# Altium schematic sheet AC DC.SchDoc
size A3; SheetNumber: 2; SheetTotal: 8
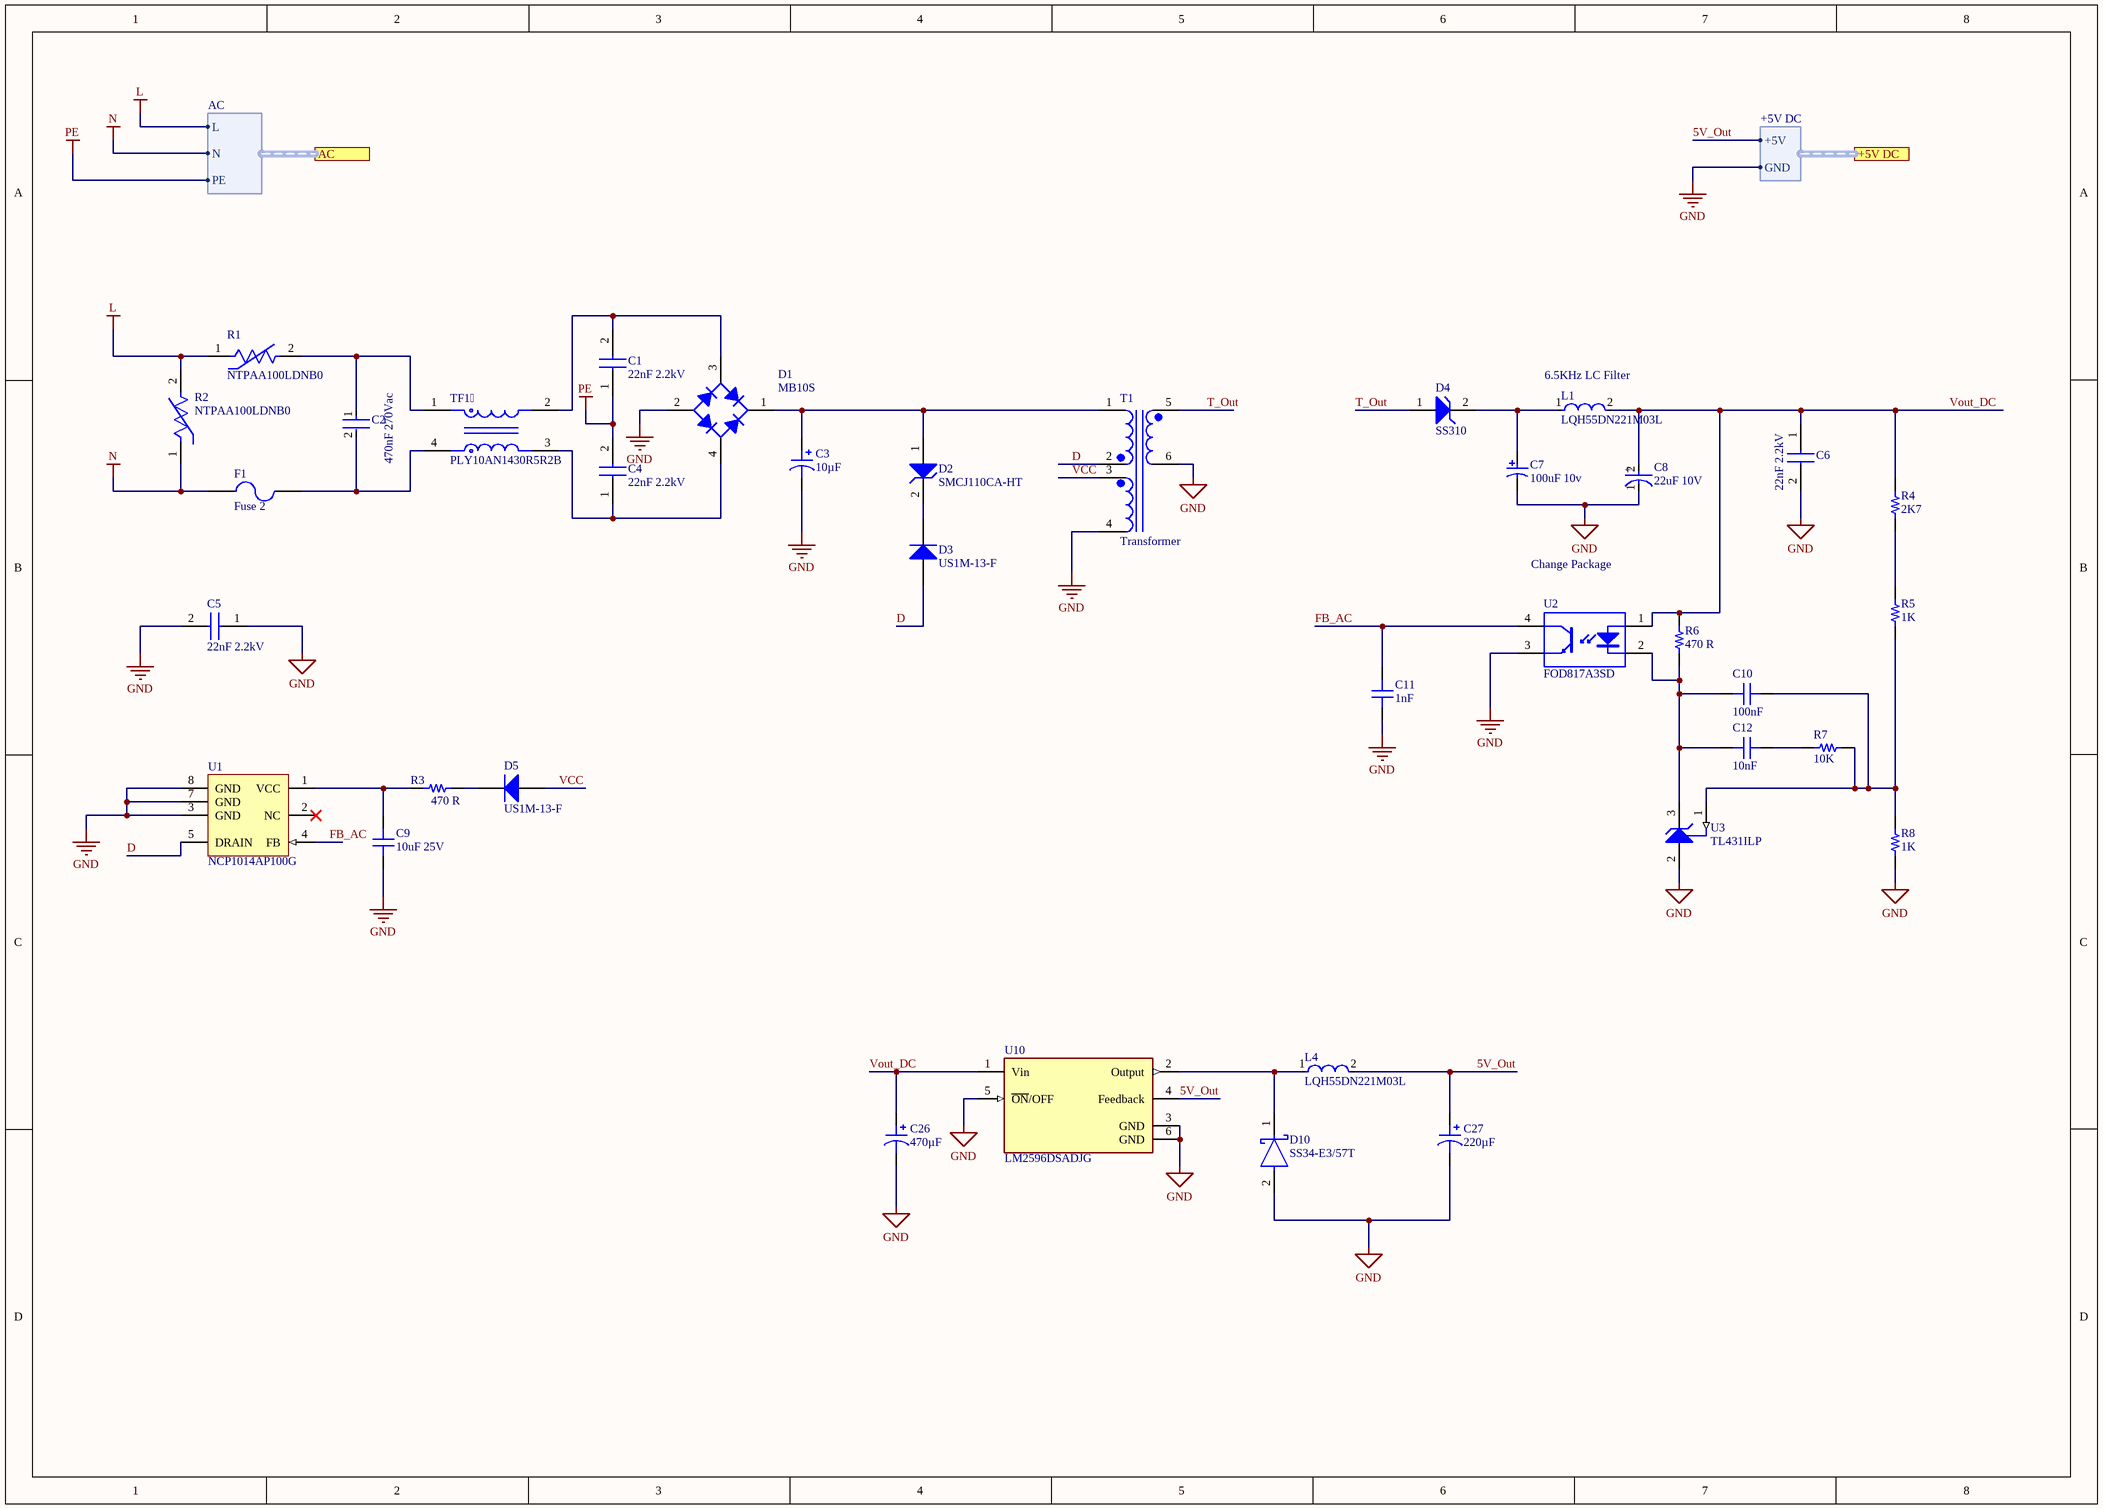
[diagram p0: AC DC.SchDoc]

## Parts
C1  22nF 2.2kV  [C901U102MYWDBA7317]
C2  470nF 270Vac  [FP-PME295RB4470MR30-MFG]
C3  10µF  [CAP TH ALUM ELEC D10.00mm S5.00mm H13.50mm]
C4  22nF 2.2kV  [C901U102MYWDBA7317]
C5  22nF 2.2kV  [C901U102MYWDBA7317]
C6  22nF 2.2kV  [C901U102MYWDBA7317]
C7  100uF 10v  [KEMT-T491-C_L]
C8  22uF 10V  [FP-T491B107M010AT-MFG]
C9  10uF 25V  [CAP 0805_2012]
C10  100nF  [CAP 0402_1005]
C11  1nF  [CAP 0603_1608]
C12  10nF  [CAP 0402_1005]
C26  470µF  [CAP TH ALUM ELEC D10.00mm S5.00mm H17.00mm]
C27  220µF  [CAP TH ALUM ELEC D8.00mm S3.50mm H12.50mm]
D1  MB10S  [FP-751EP-MFG]
D2  SMCJ110CA-HT  [STM-SMC_V]
D3  US1M-13-F  [DIOD-SMA-2_A_V]
D4  SS310  [STM-SMC_V]
D5  US1M-13-F  [DIOD-SMA-2_A_V]
D10  SS34-E3/57T  [FP-95402-MFG]
F1  Fuse 2  [PIN-W2/E2.8]
L1  LQH55DN221M03L  [FP-LQH55DN_03-MFG(100uH)]
L4  LQH55DN221M03L  [FP-LQH55DN_03-MFG(68uH) - duplicate]
R1  NTPAA100LDNB0  [FP-NTPAA-MFG]
R2  NTPAA100LDNB0  [FP-NTPAA-MFG]
R3  470 R  [RES 0805_2012]
R4  2K7  [RES 0805_2012]
R5  1K  [RES 0805_2012]
R6  470 R  [RES 0805_2012]
R7  10K  [RES 0805_2012]
R8  1K  [RES 0805_2012]
T1  Transformer
TF1  PLY10AN1430R5R2B  [FP-PLY10A-MFG]
U1  NCP1014AP100G  [ONSC-PDIP-7-626AB]
U2  FOD817A3SD  [FAIR-SMT-4_V]
U3  TL431ILP  [LP0003A]
U10  LM2596DSADJG  [FP-936A-02-MFG]

## Ports
+5V DC (harness +5V DC), AC (harness AC)

## Harnesses
AC: L, N, PE
+5V DC: +5V, GND

## Nets
GND: C3.2 C5.1 C5.2 C6.2 C7.2 C8.1(C) C9.1 C11.1 C26.2 C27.2 D1.2 D10.2(A) R8.1 T1.4 T1.6 U1.3(GND) U1.7(GND) U1.8(GND) U2.3(EMITTER) U3.2(ANODE) U10.3(GND) U10.5(~{ON}/OFF) U10.6(GND) ; port +5V DC.GND
L: R1.1 R2.2 ; port AC.L
N: F1.1 R2.1 ; port AC.N
PE: C1.1 C4.2 ; port AC.PE
5V_Out: C27.1 L4.2 U10.4(Feedback) ; port +5V DC.+5V
D: D3.1(A) T1.2 U1.5(DRAIN)
FB_AC: C11.2 U1.4(FB) U2.4(COLLECTOR)
T_Out: D4.1(A) T1.5
VCC: D5.1(A) T1.3
Vout_DC: C6.1 C8.2(A) C26.1 L1.2 R4.2 R6.2 U2.1(ANODE) U10.1(Vin)
NetC1_2: C1.2 D1.3 TF1.2
NetC2_1: C2.1 R1.2 TF1.1
NetC2_2: C2.2 F1.2 TF1.4
NetC3_1: C3.1 D1.1 D2.1(A) T1.1
NetC4_1: C4.1 D1.4 TF1.3
NetC7_1: C7.1 D4.2(K) L1.1
NetC9_2: C9.2 R3.1 U1.1(VCC)
NetC10_1: C10.1 C12.1 R6.1 U2.2(CATHODE) U3.3(CATHODE)
NetC10_2: C10.2 R5.1 R7.1 R8.2 U3.1(REF)
NetC12_2: C12.2 R7.2
NetD2_2: D2.2(K) D3.2(K)
NetD5_2: D5.2(K) R3.2
NetD10_1: D10.1(C) L4.1 U10.2(Output)
NetR4_1: R4.1 R5.2

Not connected (* = marked no-connect by the designer): U1 2(NC)*

## Notes on the sheet
- (near L1) 6.5KHz LC Filter
- Change Package
- (in symbol CMP-03017-000045-1) +

## Library data of the parts
C1 C4-C6 = C901U102MYWDBA7317: Capacitor; Manufacturer_Name: Kemet; Datasheet Link: https://componentsearchengine.com/Datasheets/2/C901U102MYWDBA7317.pdf; Height: 10mm; Manufacturer_Part_Number: C901U102MYWDBA7317; Mouser Part Number: 80-C901U102MYWDBAP; Mouser Price/Stock: https://www.mouser.co.uk/ProductDetail/KEMET/C901U102MYWDBA7317?qs=gqcQgTT0fkjoP%252BsjEfHKjQ%3D%3D
C2 = CMP-03022-000001-1: CAP FILM 4700PF 20% 1.5KVDC RAD; Manufacturer: Kemet; Manufacturer Part Number: PME295RB4470MR30; Material: Metallized Impregnated Paper; Value: 0.0047uF; Voltage Rating: 1500V; Voltage Rating Ac: 480V; Lead Free: Yes; Category: Cap; ComponentLink2URL: https://content.kemet.com/datasheets/KEM_F3064_PME295_Y1_440-480.pdf; RoHS: TRUE; ComponentLink2Description: Datasheet; Device Class L1: Passive Components; Octopart: https://octopart.com/pme295rb4470mr30-kemet-8375873; Temperature: -40°C to +115°C; Temperature Range Low: -40°C; Automotive: No; Height: 16mm; Mouser Description: Film Capacitors 440volts 4700pF 20% LS 15mm; Capacitance: 0.0047uF; Temperature Range High: +115°C; Tolerance: 20%; Device Class L3: Film Capacitors; Device Class L2: Capacitors; Package: 0; Digikey Description: CAP FILM 4700PF 20% 1.5KVDC RAD
C3 = ECA-2CM100: CAP ALUM 10UF 20% 160V RADIAL; Manufacturer: Panasonic Electronic Components; Lifetime @ Temp.: 2000 Hrs @ 85°C; Polarization: Polar; Ripple Current @ High Frequency: 178.5mA @ 10kHz; Ripple Current @ Low Frequency: 105mA @ 120Hz; Part Number: ECA-2CM100; Applications: General Purpose; Capacitance: 10µF; ComponentLink1Description: Datasheet; ComponentLink1URL: //media.digikey.com/pdf/Data%20Sheets/Panasonic%20Electronic%20Components/ECA-xxM%20Series,TypeA.pdf; ComponentLink2Description: DigiKey Link; ComponentLink2URL: http://digikey.com/product-detail/en/panasonic-electronic-components/ECA-2CM100/P5322-ND/245076; Device Package: Radial, Can; Height - Seated (Max): 0.532" (13.50mm); LastUpdated: 2.09.2020 01:31:06; Lead Spacing: 0.197" (5.00mm); Lifecycle Status: Active; Minimum Order: 1; Mounting Type: Through Hole; Operating Temperature: -25°C ~ 85°C; Package / Case: Radial, Can; Packaging: Bulk; PartId: 10778; Part Status: Active; Price: 0.48; Series: M; Size / Dimension: 0.394" Dia (10.00mm); Supplier 1: DigiKey; Supplier Part Number 1: P5322-ND; Tolerance: ±20%; Value: 10µF; Voltage - Rated: 160V
C7 = CMP-2000-07195-1: Tantalum Capacitor, 1 uF, +/- 10%, 50 V, -55 to 125 degC, 2-Pin SMD, RoHS, Tape and Reel; Manufacturer: Kemet; Capacitance: 1000000pF; Rad Hardened: No; Case Style: Molded; Product Diameter (mm): NotRequiredmm; Seal: NotRequired; DF: 4%; ESR: 5.5ohm; DCL: 0.5uA; Product Length (mm): 6mm; Product Height (mm): 2.5mm; Polarity: Polar; Voltage: 50VDC; Product Depth (mm): 3.2mm; Operating Temp Range: -55Cto125C; Package Description: 2-Pin Surface Mount Device, Body 6 x 3.2 mm; Failure Rate: NotRequired; Seated Plane Height: NotRequiredmm; Lead Spacing (nom): NotRequiredmm; Packaging: TapeandReel; Case Code: C; Length W/Weld: NotRequiredmm; Tolerance (+ or -): 10%; Datasheet URL: http://capacitoredge.kemet.com/capedge2/DataSheet/Datasheet-T491C105K050AT.pdf?pn=T491C105K050AT; Datasheet Version: 10/2016; Manufacturer URL: http://www.kemet.com/; Wire Form: NotRequired; Package / Case: 6032-28; Mounting Technology: SurfaceMount; Construction: SMTChip; Package Reference: T491-C; Length W/Weld (max): NotRequiredmm; Insulation: NotRequired; Mounting Style: SurfaceMount
C8 = CMP-03017-000045-1: CAP TANT 100UF 20% 10V 1411; Tolerance: 10%; ESR (Equivalent Series Resistance): 3R; Life (Hours): 2000Hour; Polarity: Polar; Dissipation Factor: 15%; Weight: 0.002293oz; Packaging: Tape and Reel; Package Quantity: 1; Case Code (Imperial): 1411; Width: 0.11inch; Mount: Surface Mount; Construction: Flat; Radiation Hardening: No; Height - Seated (Max): 0.083inch; Capacitance: 100uF; Length: 3.5mm; RoHS Compliant: Yes; Voltage Rating: 10V; Voltage Rating (DC): 10V; Features: General Purpose; REACH SVHC: No SVHC; Case/Package: 1411; Case Code (Metric): 3528; Series: T491; Depth: 2.8mm; Height: 2.1mm; Lead Free: Lead Free; Max Operating Temperature: 125°C; Voltage: 10V; Termination: SMD/SMT; Min Operating Temperature: -55°C
C9 = CBR08C330JAGAC: CAP CER 33PF 250V C0G/NP0 0805; Manufacturer: KEMET; Temperature Coefficient: C0G, NP0; Tolerance: ±5%; Part Number: CBR08C330JAGAC; Value: 10uF 25V; Applications: RF, Microwave, High Frequency; Capacitance: 33pF; ComponentLink1Description: Datasheet; ComponentLink1URL: https://api.kemet.com/component-edge/download/datasheet/CBR08C330JAGAC.pdf; ComponentLink2Description: DigiKey Link; ComponentLink2URL: http://digikey.com/product-detail/en/kemet/CBR08C330JAGAC/399-6202-1-ND/2732182; Device Package: 0805 (2012 Metric); Features: High Q, Low Loss, Ultra Low ESR; LastUpdated: 2.09.2020 01:04:42; Lifecycle Status: Active; Minimum Order: 1; Mounting Type: Surface Mount, MLCC; Operating Temperature: -55°C ~ 125°C; Package / Case: 0805 (2012 Metric); Packaging: TapeAndReel; PartId: 2409; Part Status: Active; Price: 0.44; Series: CBR-SMD RF C0G; Size / Dimension: 0.079" L x 0.049" W (2.00mm x 1.25mm); Supplier 1: DigiKey; Supplier Part Number 1: 399-6202-1-ND; Thickness (Max): 0.035" (0.88mm); Voltage - Rated: 250V
C10 C12 = C0402C151F5GAC7867: CAP CER 150PF 50V NP0 0402; Manufacturer: KEMET; Temperature Coefficient: C0G, NP0; Tolerance: ±1%; Part Number: C0402C151F5GAC7867; Applications: General Purpose; Capacitance: 150pF; ComponentLink1Description: Datasheet; ComponentLink1URL: https://api.kemet.com/component-edge/download/datasheet/C0402C151F5GAC7867.pdf; ComponentLink2Description: DigiKey Link; ComponentLink2URL: http://digikey.com/product-detail/en/kemet/C0402C151F5GAC7867/399-14269-1-ND/6827260; Device Package: 0402 (1005 Metric); Features: Low ESL; LastUpdated: 2.09.2020 01:02:26; Lifecycle Status: Active; Minimum Order: 1; Mounting Type: Surface Mount, MLCC; Operating Temperature: -55°C ~ 125°C; Package / Case: 0402 (1005 Metric); Packaging: TapeAndReel; PartId: 1709; Part Status: Active; Price: 0.43; Series: SMD Comm C0G; Size / Dimension: 0.039" L x 0.020" W (1.00mm x 0.50mm); Supplier 1: DigiKey; Supplier Part Number 1: 399-14269-1-ND; Thickness (Max): 0.022" (0.55mm); Voltage - Rated: 50V
  C10: Value: 100nF
  C12: Value: 10nF
C11 = C0603X101F5GACAUTO: CAP CER 100PF 50V C0G/NP0 0603; Manufacturer: KEMET; Temperature Coefficient: C0G, NP0; Tolerance: ±1%; Part Number: C0603X101F5GACAUTO; Value: 1nF; Applications: Automotive, Boardflex Sensitive; Capacitance: 100pF; ComponentLink1Description: Datasheet; ComponentLink1URL: https://api.kemet.com/component-edge/download/datasheet/C0603X101F5GACAUTO.pdf; ComponentLink2Description: DigiKey Link; ComponentLink2URL: http://digikey.com/product-detail/en/kemet/C0603X101F5GACAUTO/399-20434-1-ND/9925038; Device Package: 0603 (1608 Metric); Features: Low ESL, Soft Termination; LastUpdated: 2.09.2020 01:03:36; Lifecycle Status: Active; Minimum Order: 1; Mounting Type: Surface Mount, MLCC; Operating Temperature: -55°C ~ 125°C; Package / Case: 0603 (1608 Metric); Packaging: TapeAndReel; PartId: 2136; Part Status: Active; Price: 0.44; Ratings: AEC-Q200; Series: SMD Auto C0G Flex; Size / Dimension: 0.063" L x 0.031" W (1.60mm x 0.80mm); Supplier 1: DigiKey; Supplier Part Number 1: 399-20434-1-ND; Thickness (Max): 0.037" (0.95mm); Voltage - Rated: 50V
C26 = ECA-1VM471B: CAP ALUM 470UF 20% 35V RADIAL; Manufacturer: Panasonic Electronic Components; Lifetime @ Temp.: 2000 Hrs @ 85°C; Polarization: Polar; Ripple Current @ High Frequency: 935mA @ 10kHz; Ripple Current @ Low Frequency: 550mA @ 120Hz; Part Number: ECA-1VM471B; Applications: General Purpose; Capacitance: 470µF; ComponentLink1Description: Datasheet; ComponentLink1URL: //media.digikey.com/pdf/Data%20Sheets/Panasonic%20Electronic%20Components/ECA-xxM%20Series,TypeA.pdf; ComponentLink2Description: DigiKey Link; ComponentLink2URL: http://digikey.com/product-detail/en/panasonic-electronic-components/ECA-1VM471B/P10386TB-ND/268471; Device Package: Radial, Can; Height - Seated (Max): 0.669" (17.00mm); LastUpdated: 2.09.2020 01:31:21; Lead Spacing: 0.197" (5.00mm); Lifecycle Status: Active; Minimum Order: 500; Mounting Type: Through Hole; Operating Temperature: -40°C ~ 85°C; Package / Case: Radial, Can; Packaging: TapeAndBox; PartId: 11779; Part Status: Active; Price: 0.15; Series: M; Size / Dimension: 0.394" Dia (10.00mm); Supplier 1: DigiKey; Supplier Part Number 1: P10386TB-ND; Tolerance: ±20%; Value: 470µF; Voltage - Rated: 35V
C27 = UKW1E221MPD1TD: CAP ALUM 220UF 20% 25V RADIAL; Manufacturer: Nichicon; Lifetime @ Temp.: 2000 Hrs @ 85°C; Polarization: Polar; Ripple Current @ Low Frequency: 320mA @ 120Hz; Part Number: UKW1E221MPD1TD; Applications: Audio; Capacitance: 220µF; ComponentLink1Description: Datasheet; ComponentLink1URL: http://nichicon-us.com/english/products/pdfs/e-ukw.pdf; ComponentLink2Description: DigiKey Link; ComponentLink2URL: http://digikey.com/product-detail/en/nichicon/UKW1E221MPD1TD/493-10759-1-ND/4317735; Device Package: Radial, Can; Height - Seated (Max): 0.492" (12.50mm); LastUpdated: 7.09.2020 05:24:52; Lead Spacing: 0.138" (3.50mm); Lifecycle Status: Active; Minimum Order: 1; Mounting Type: Through Hole; Operating Temperature: -40°C ~ 85°C; Package / Case: Radial, Can; Packaging: TapeAndBox; PartId: 7197; Part Status: Active; Price: 0.16; Series: UKW; Size / Dimension: 0.315" Dia (8.00mm); Supplier 1: DigiKey; Supplier Part Number 1: 493-10759-1-ND; Tolerance: ±20%; Value: 220µF; Voltage - Rated: 25V
D1 = CMP-07163-000045-1: BRIDGE RECT 1P 1KV 500MA 4SOIC; Capacitance: 470pF; Forward Current: 800mA; Element Configuration: Single; Number of Elements: 1; Max Forward Surge Current (Ifsm): 35A; Lead/Base Style: Formed Leads; Forward Voltage: 1V; Tolerance: 10%; Voltage Rating: 500V; Max Power Dissipation: 1.4W; Peak Reverse Current: 5uA; Case/Package: SOIC; Min Operating Temperature: -55°C; Package Quantity: 500; Height: 2.7mm; Mount: Surface Mount; Average Rectified Current: 500mA; Radiation Hardening: No; Width: 4.2mm; Peak Non-Repetitive Surge Current: 35A; REACH SVHC: No SVHC; Max Repetitive Reverse Voltage (Vrrm): 1kV; Weight: 0.228g; Length: 4.95mm; Height - Seated (Max): 0.354inch; Case Code (Imperial): 1206; Thickness: 0.039inch; Packaging: Tape and Reel; Lead Free: Lead Free; Case Code (Metric): 3216; Contact Plating: Tin; Reverse Voltage (DC): 1kV; Number of Pins: 4; Max Operating Temperature: 150°C; Lead Pitch: 0.197inch; Max Surge Current: 35A
D2 D4 = CMP-0433-00001-1: SMCJ Transil Series Zener Diode, 5V, 5W; PartNumber: SMCJ5.0A-TR; Manufacturer: STMicroelectronics; Junction Temperature: -55 to 150 degC; DatasheetVersion: Rev. 8, 07/2010; ComponentLink1URL: http://www.st.com; ComponentLink2Description: Datasheet; Mounting Technology: Surface Mount; PackageReference: SMC; PackageDescription: 2-Pin C-Bend SMT Diode, 7.9 x 5.9 mm Body; ComponentLink2URL: http://www.st.com/st-web-ui/static/active/en/resource/technical/document/datasheet/CD00001367.pdf; ComponentLink1Description: Manufacturer URL
D3 D5 = CMP-2000-07364-1: Ultra-Fast Rectifier, 1 A, 1.7 V, -65 to 150 degC, 2-Pin SMA, RoHS, Tape and Reel; Manufacturer: Diodes Inc; Forward Voltage: 1.7V; Reverse Recovery Time-Max: 75ns; Average Rectified Current-Max: 1A; Reverse Current-Max: 5µA; Reverse Voltage-Max [Vrrm]: 1000V; Package Description: 2-Pin Surface Mount Device, Body 4.3 x 2.605 mm; Datasheet URL: http://www.diodes.com/_files/datasheets/ds16008.pdf; Datasheet Version: Rev. 11-2, 12/2014; Package Reference: SMA-2; Mounting Technology: SurfaceMount; Manufacturer URL: http://www.diodes.com/
D10 = CMP-02539-000012-1: DIODE SCHOTTKY 40V 3A DO214AB; Manufacturer: Vishay; Max Junction Temp: +150°C; Peak Reverse Current: 0.5mA; Max Surge Forward Current: 100A; Standoff Height: 0mm; ComponentLink2Description: Datasheet; Device Class L3: Schottky Diodes; Height: 2.62mm; Max Repetitive Reverse Voltage: 40V; Lead Free: Yes; Package: 95402; Temperature Range High: +150°C; ComponentLink2URL: http://www.vishay.com/docs/88751/ss32.pdf; Temperature: -55°C to +150°C; Footprint Url: http://www.vishay.com/docs/95402/smc.pdf; Automotive: No; Forward Current: 3A; Category: Diode; Manufacturer Part Number: SS34-E3/57T; RoHS: TRUE; Device Class L2: Diodes; Mouser Description: Schottky Diodes & Rectifiers 3.0 Amp 40 Volt; Octopart: https://octopart.com/ss34-e3%2F57t-vishay-39552907; Temperature Range Low: -55°C; Device Class L1: Discrete Semiconductors; Digikey Description: DIODE SCHOTTKY 40V 3A DO214AB
F1 = Fuse 2: Fuse; Published: 8-Jun-2000; LatestRevisionDate: 17-Jul-2002; LatestRevisionNote: Re-released for DXP Platform.; PackageReference: PIN-W2/E2.8; Publisher: Altium Limited; PackageDescription: Thru-Hole; 2 Leads
L1 = CMP-06042-002541-1: Wire Wound Ferrite Inductor for Power Lines 220μH ±20% 3.36Ω  0.32A 2220; Shielding: Unshielded; Current Rating: 320mA; Series Resistance: 2.4R; Inductance: 220uH; Self Resonant Frequency: 4MHz; Test Frequency: 100kHz; Weight: 0.016932oz; Case Code (Imperial): 2220; Width: 0.197inch; Radiation Hardening: No; Tolerance: 20%; Military Standard: Not; Case Code (Metric): 5750; Height - Seated (Max): 0.198inch; Depth: 5.3mm; Min Operating Temperature: -40°C; Lead Free: Lead Free; Case/Package: 2220; Length: 5.7mm; Max DC Current: 320mA; Termination: SMD/SMT; Height: 4.7mm; Package Quantity: 350; Packaging: Tape and Reel; Mount: Surface Mount; DC Current: 320mA; REACH SVHC: No SVHC; Resistor Type: Wirewound; Max Operating Temperature: 80°C; DC Resistance (DCR): 2.4R; Inductance Tolerance: 20%; Core Material: Ferrite
L4 = 68uH inductor: Wire Wound Ferrite Inductor for Power Lines 220μH ±20% 3.36Ω  0.32A 2220; Shielding: Unshielded; Current Rating: 320mA; Series Resistance: 2.4R; Inductance: 220uH; Self Resonant Frequency: 4MHz; Test Frequency: 100kHz; Weight: 0.016932oz; Case Code (Imperial): 2220; Width: 0.197inch; Radiation Hardening: No; Tolerance: 20%; Military Standard: Not; Case Code (Metric): 5750; Height - Seated (Max): 0.198inch; Depth: 5.3mm; Min Operating Temperature: -40°C; Lead Free: Lead Free; Case/Package: 2220; Length: 5.7mm; Max DC Current: 320mA; Termination: SMD/SMT; Height: 4.7mm; Package Quantity: 350; Packaging: Tape and Reel; Mount: Surface Mount; DC Current: 320mA; REACH SVHC: No SVHC; Resistor Type: Wirewound; Max Operating Temperature: 80°C; DC Resistance (DCR): 2.4R; Inductance Tolerance: 20%; Core Material: Ferrite
R1 R2 = CMP-06022-000465-1: ICL 10 OHM 15% 1.7A 10MM; Mount: Through Hole; Lead Free: Lead Free; Tolerance: 15%; Lead Pitch: 0.295inch; Max Operating Temperature: 160°C; Radiation Hardening: No; Diameter: 0.394inch; Current Rating: 1.7A; Min Operating Temperature: -20°C; Packaging: Bulk; Number of Pins: 2; Depth: 5mm; Thickness: 5mm
R3-R8 = TLRZ2ATTD: RES 0 OHM JUMPER 0805; Manufacturer: KOA Speer Electronics, Inc.; Part Number: TLRZ2ATTD; ComponentLink1Description: Datasheet; ComponentLink1URL: http://www.koaspeer.com/catimages/Products/TLRZ/TLRZ.pdf; ComponentLink2Description: DigiKey Link; ComponentLink2URL: http://digikey.com/product-detail/en/koa-speer-electronics-inc/TLRZ2ATTD/2019-TLRZ2ATTDCT-ND/9847538; Composition: Metal Element; Device Package: 0805 (2012 Metric); Features: Automotive AEC-Q200, Current Sense; Height - Seated (Max): 0.022" (0.55mm); LastUpdated: 2.09.2020 01:15:24; Lifecycle Status: Active; Minimum Order: 1; Number of Terminations: 2; Operating Temperature: -55°C ~ 170°C; Package / Case: 0805 (2012 Metric); Packaging: TapeAndReel; PartId: 27685; Part Status: Active; Price: 0.09; Ratings: AEC-Q200; Series: TLRZ; Size / Dimension: 0.079" L x 0.049" W (2.00mm x 1.25mm); Supplier 1: DigiKey; Supplier Part Number 1: 2019-TLRZ2ATTDCT-ND; Supplier Device Package: 0805; Tolerance: Jumper
T1 = Transformer: International One-4-All Triple Output Transformer | 30VA Power | 115V/230V Input; MP: 14A-30-515; MF: Bel; Price: None; Value: *; Package: Non-Standard Signal Transformer; Purchase-URL: https://pricing.snapeda.com/search/part/14A-30-515/?ref=eda; SnapEDA_Link: https://www.snapeda.com/parts/14A-30-515/Signal%20Transformer/view-part/3603902/?ref=snap; Availability: Bad
TF1 = CMP-06045-000516-1: Common Mode Choke Dual 14mH 0.5A 2.5Ω DCR Thru-Hole Bulk; Max DC Current: 500mA; Shielding: Unshielded; Voltage Rating: 300V; Lead Diameter: 3.5mm; DC Resistance (DCR): 100mR; Inductance: 14mH; Min Operating Temperature: -25°C; Height: 17.5mm; Lead Free: Lead Free; Termination: Radial; Radiation Hardening: No; Max Operating Temperature: 120°C; Depth: 16mm; Width: 16mm; DC Current: 500mA; Current Rating: 500mA; Mount: Radial; Length: 18mm; Package Quantity: 1200; Packaging: Bulk
U1 = CMP-0928-00002-1: Self-Supplied Monolithic Switcher for Low Standby-Power Offline SMPS, 100 KHz, 450 mA, -40 to 125 degC, 7-Pin PDIP, Tube; Manufacturer: ON Semiconductor; DSS (mA): 8; RDS (ON) Typ.: 11 Ohm; Frequency Typ.: 100 KHz; Ipeak: 450 mA; V (BR) DSS Max.: 700 V; Operating Temperature: -40 to 125 degC; ComponentLink2Description: Datasheet; PartNumber: NCP1014AP100G; PackageVersion: Rev. B; ComponentLink3URL: http://www.onsemi.com/pub_link/Collateral/626A-01.PDF; DatasheetVersion: Rev. 22; ComponentLink3Description: Package Specification; ComponentLink1URL: http://www.onsemi.com/; ComponentLink2URL: http://www.onsemi.com/pub_link/Collateral/NCP1010-D.PDF; ComponentLink1Description: Manufacturer URL; PackageDescription: 7-Pin Plastic Dual-In-Line Package, Body 9.59 x 6.605 mm, Pitch 2.54 mm; PackageReference: PDIP-7-626AB; Mounting Technology: Through Hole; Packing: Tube
U2 = CMP-2000-06278-1: Phototransistor Optocoupler, 1.2 V, -55 to 110 degC, 4-Pin SMT, RoHS, Tape and Reel; Manufacturer: Fairchild Semiconductor; Reverse Breakdown Voltage: 6V; Forward Current: 50mA; Rise Time: 18000ns; Isolation Voltage: 5000V; Number of  Elements: 1; Power Dissipation: 0.2W; Collector-Emitter Voltage: 70V; Collector Current (DC) (Max): 0.05A; Current Transfer Ratio: 160%; DELETED: Compliant; Collector-Emitter Saturation Voltage: 0.2V; Output Type: DC; Rad Hardened: No; Forward Voltage: 1.4V; Datasheet URL: https://www.fairchildsemi.com/datasheets/FO/FOD814A.pdf; Package Reference: SMT-4; Package URL: https://www.fairchildsemi.com/package-drawings/N0/N04C.pdf; Pin Count: 4; Collector Current (DC): 0.05A; Datasheet Version: Rev. 2.8, 11/2015; Mounting: SurfaceMount; Package Description: 4-Pin Surface Mount Device, Body 6.5 x 4.6 mm, Pitch 2.54 mm; Packaging: TapeandReel; Fall Time: 18000ns; Operating Temperature Classification: Industrial; Manufacturer URL: https://www.fairchildsemi.com/; Input Type: DC; Operating Temp Range: -55Cto110C; Output Device: Transistor; Package Type: PDIP-BSMD; Mounting Technology: SurfaceMount
U3 = CMP-0366-00043-2: Adjustable Precision Shunt Regulator, 34 ppm / degC, 100 mA, -40 to 85 degC, 3-pin TO-92 (LP), Pb-Free (RoHS); Manufacturer: Texas Instruments; Iout/Iz(Max)(mA): 100; Rating: Military; Temp Coeff(Typ)(ppm/ degree C): 34; Initial Accuracy @ 25/deg C(%): 2; SubFamily: Shunt Voltage Reference; VO Adj(Max)(V): 36; VO Adj(Min)(V): 2.495; Temp Coeff(Max)(ppm/ degree C): 92; Min Iz for Regulation(uA): 600; PackageReference: LP0003A; ComponentLink1URL: http://www.ti.com/; ComponentLink1Description: Manufacturer URL; Eco-Plan: Pb-Free (RoHS); ComponentLink3URL: http://www.ti.com/litv/pdf/msot002a; PartNumber: TL431ILP; DatasheetVersion: SLVS543M; ComponentLink2Description: Datasheet; Mounting Technology: Through Hole; ComponentLink3Description: Package Specification; PackageDescription: Plastic Cylindrical Package, Formed Lead Option (TO-92); ComponentLink2URL: http://www.ti.com/general/docs/lit/getliterature.tsp?genericPartNumber=TL431&fileType=pdf; Code_JEDEC: TO-226; PackageVersion: 4040001-2/C
U10 = CMP-07129-000001-1: IC REG MULT CONFG ADJ 3A D2PAK-5; Manufacturer: ON Semiconductor; Max Duty Cycle: 95%; Nominal Supply Current: 5mA; Standoff Height: 0mm; Min Supply Voltage: 4.5V; Output Voltage: 1.23-37V; Negative Voltage Available: true; Number Of Outputs: 1; Max Junction Temp: +125°C; Output Type: AdjustableProgrammable; Max Supply Voltage: 40V; Switching Topology: Boost,Buck,Buck-Boost; Switching Frequency: 150Hz; Output Current: 3A; Device Class L1: Integrated Circuits (ICs); Height: 4.826mm; Manufacturer Part Number: LM2596DSADJG; ComponentLink2URL: https://www.onsemi.com/pub/Collateral/LM2596-D.PDF; Device Class L3: Voltage Regulators - Switching; Octopart: https://octopart.com/lm2596dsadjg-on+semiconductor-12437034; Mouser Description: Voltage Regulators - Switching Regulators 3A BUCK SWCH 150KHZ; Automotive: No; RoHS: TRUE; Temperature Range High: +125°C; ComponentLink2Description: Datasheet; Device Class L2: Power Management ICs; Digikey Description: IC REG MULT CONFG ADJ 3A D2PAK-5; Temperature Range Low: -40°C; Footprint Url: https://www.onsemi.com/pub/Collateral/936A-02.PDF; Lead Free: Yes; Temperature: -40°C to +125°C; Package: 936A-02; Category: IC